# Altium project MAX268.PrjPCB
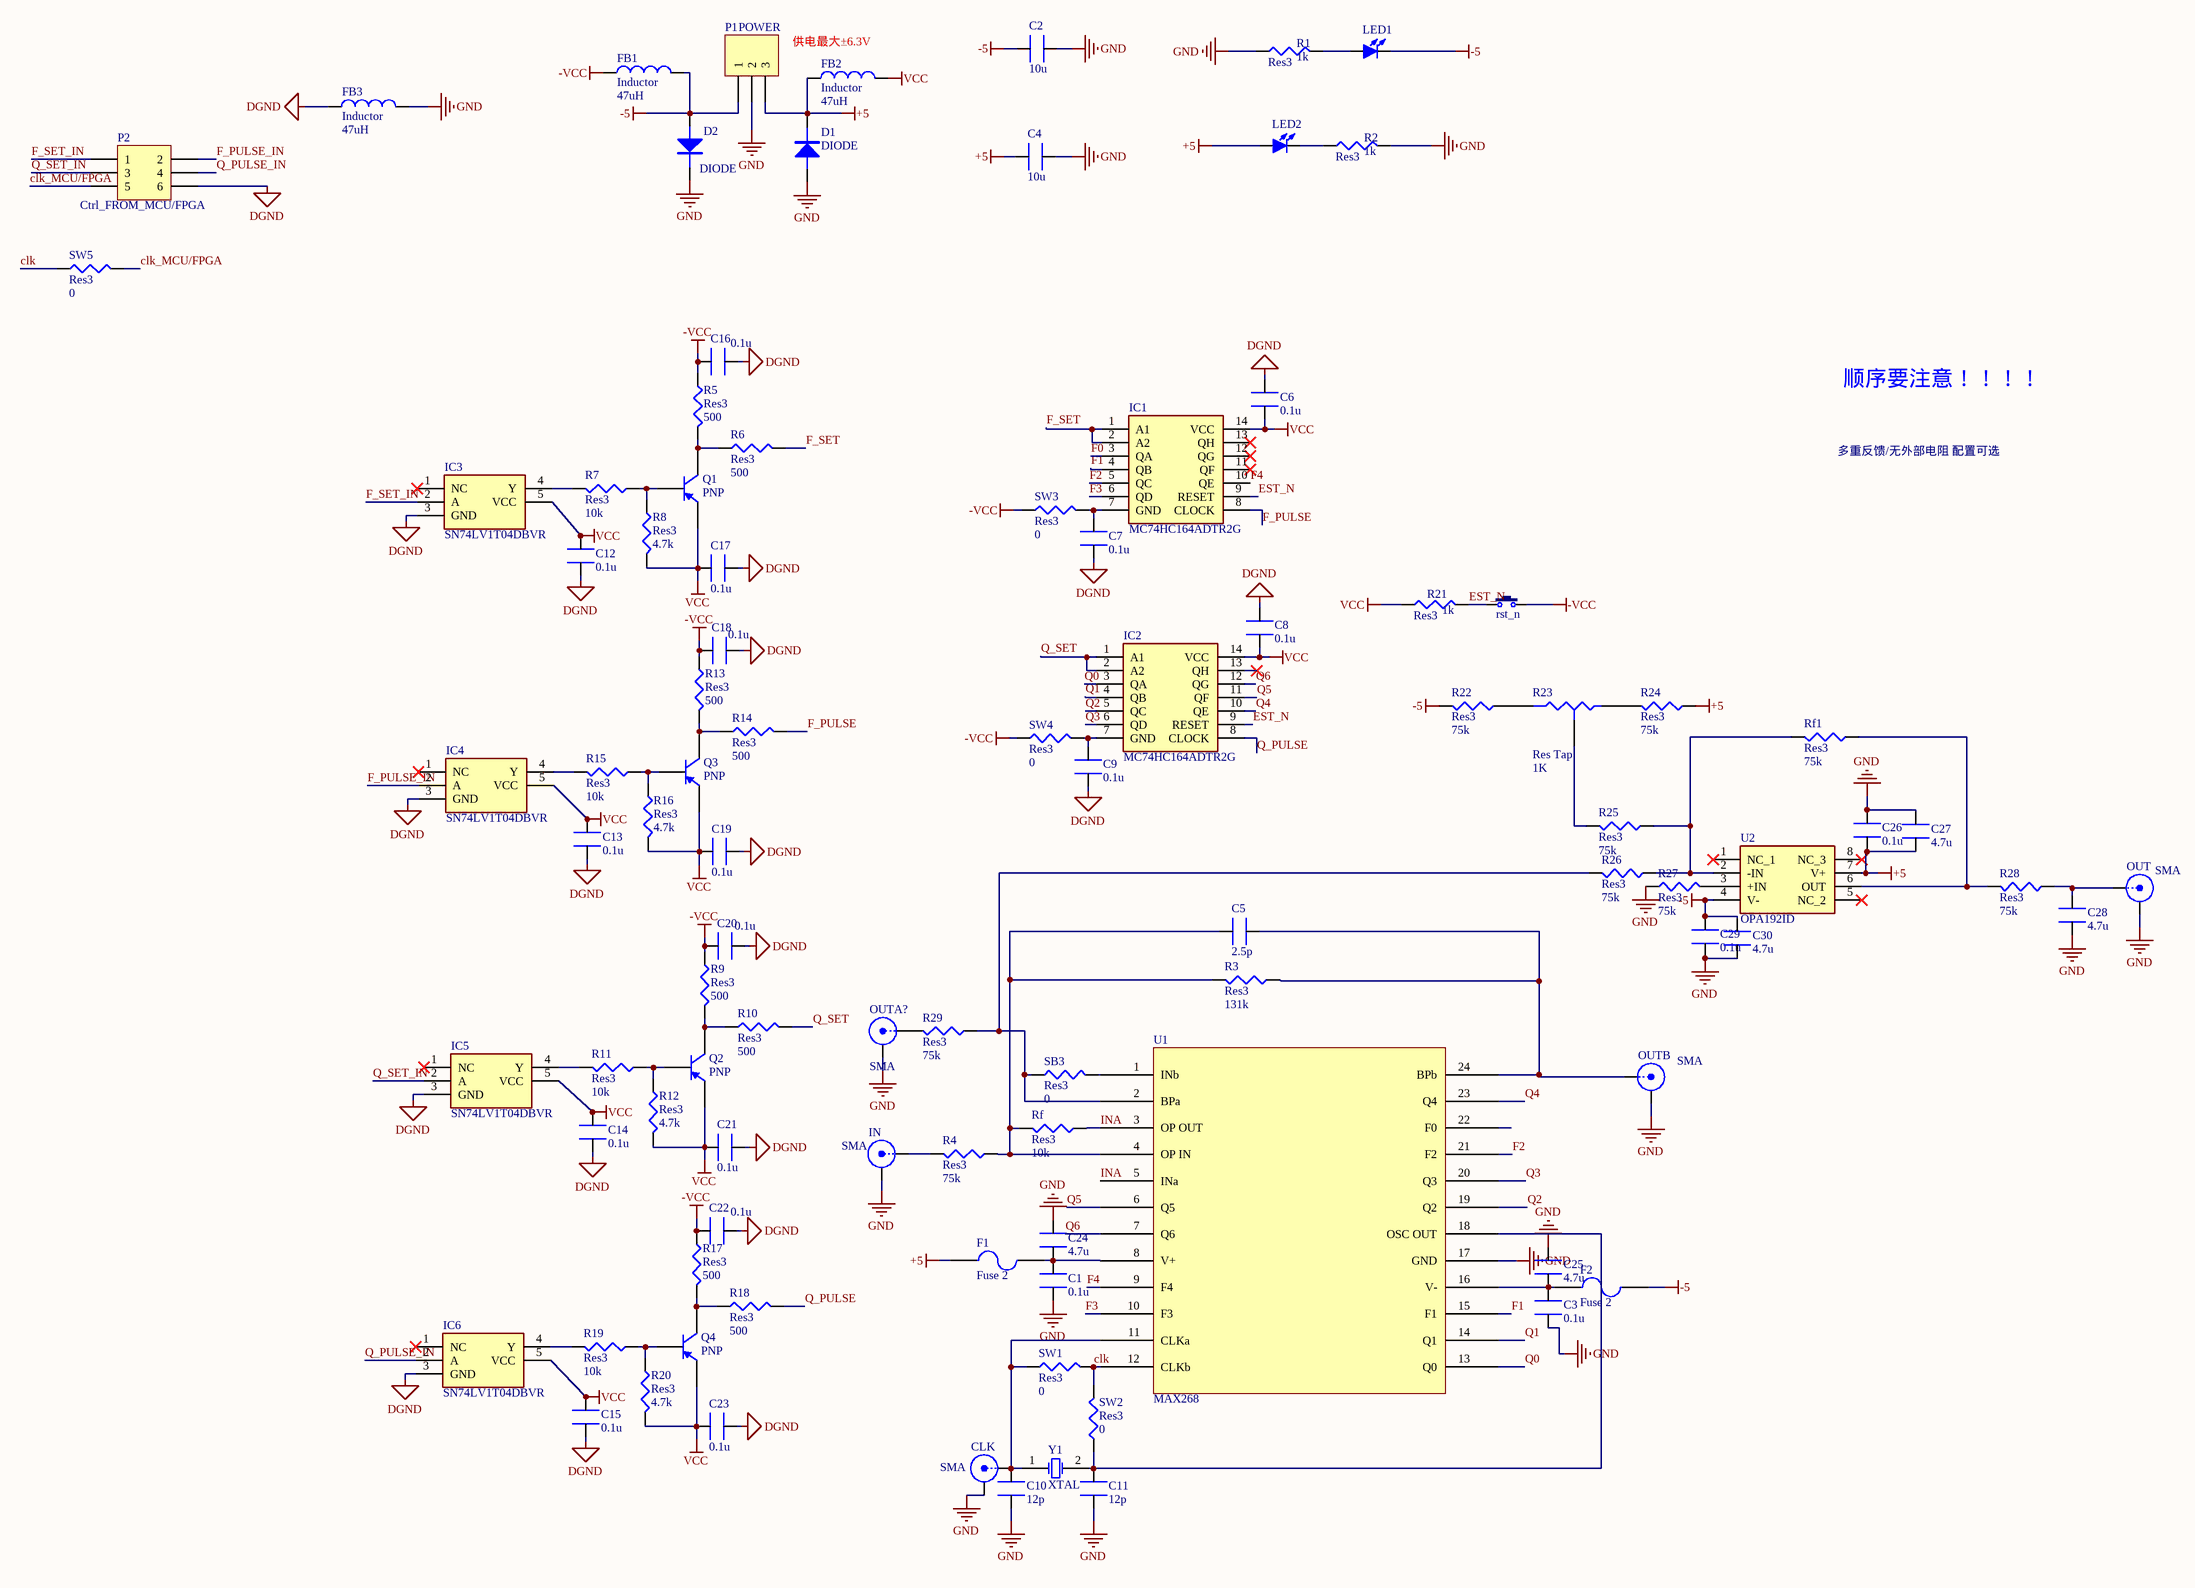
[diagram p0: MAX268.SchDoc]
1 sheet, 97 parts. Net scope: global (net labels, ports and power ports of the same name join across sheets).
Board file: max268.PcbDoc

## Sheet MAX268.SchDoc
size A2; Organization: Altium Limited; Address1: L3, 12a Rodborough Rd; Address2: Frenchs Forest; Address3: NSW; Address4: Australia 2086

### Parts
C1  0.1u  [0805D]
C2  10u  [0805D]
C3  0.1u  [0805D]
C4  10u  [0805D]
C5  2.5p  [0805D]
C6  0.1u  [0805D]
C7  0.1u  [0805D]
C8  0.1u  [0805D]
C9  0.1u  [0805D]
C10  12p  [0805D]
C11  12p  [0805D]
C12  0.1u  [0805D]
C13  0.1u  [0805D]
C14  0.1u  [0805D]
C15  0.1u  [0805D]
C16  0.1u  [0805D]
C17  0.1u  [0805D]
C18  0.1u  [0805D]
C19  0.1u  [0805D]
C20  0.1u  [0805D]
C21  0.1u  [0805D]
C22  0.1u  [0805D]
C23  0.1u  [0805D]
C24  4.7u  [0805D]
C25  4.7u  [0805D]
C26  0.1u  [0805D]
C27  4.7u  [0805D]
C28  4.7u  [0805D]
C29  0.1u  [0805D]
C30  4.7u  [0805D]
CLK  SMA  [SMA1]
D1  DIODE  [1206A]
D2  DIODE  [1206A]
F1  Fuse 2  [0805D]
F2  Fuse 2  [0805D]
FB1  Inductor  value 47uH  [0805D]
FB2  Inductor  value 47uH  [0805D]
FB3  Inductor  value 47uH  [0805D]
IC1  MC74HC164ADTR2G  [SOP65P640X120-14N]
IC2  MC74HC164ADTR2G  [SOP65P640X120-14N]
IC3  SN74LV1T04DBVR  [SOT95P280X145-5N]
IC4  SN74LV1T04DBVR  [SOT95P280X145-5N]
IC5  SN74LV1T04DBVR  [SOT95P280X145-5N]
IC6  SN74LV1T04DBVR  [SOT95P280X145-5N]
IN  SMA  [SMA1]
LED1  (no value)  [0805D]
LED2  (no value)  [0805D]
OUT  SMA  [SMA1]
OUTA?  SMA  [SMA1]
OUTB  SMA  [SMA1]
P1  POWER  [HDR1X3]
P2  Ctrl_FROM_MCU/FPGA  [HDR2X3]
Q1  PNP  [SOT-23B_M]
Q2  PNP  [SOT-23B_M]
Q3  PNP  [SOT-23B_M]
Q4  PNP  [SOT-23B_M]
R1  Res3  value 1k  [0805D]
R2  Res3  value 1k  [0805D]
R3  Res3  value 131k  [0805D]
R4  Res3  value 75k  [0805D]
R5  Res3  value 500  [0805D]
R6  Res3  value 500  [0805D]
R7  Res3  value 10k  [0805D]
R8  Res3  value 4.7k  [0805D]
R9  Res3  value 500  [0805D]
R10  Res3  value 500  [0805D]
R11  Res3  value 10k  [0805D]
R12  Res3  value 4.7k  [0805D]
R13  Res3  value 500  [0805D]
R14  Res3  value 500  [0805D]
R15  Res3  value 10k  [0805D]
R16  Res3  value 4.7k  [0805D]
R17  Res3  value 500  [0805D]
R18  Res3  value 500  [0805D]
R19  Res3  value 10k  [0805D]
R20  Res3  value 4.7k  [0805D]
R21  Res3  value 1k  [0805D]
R22  Res3  value 75k  [0805D]
R23  Res Tap  value 1K  [VR3]
R24  Res3  value 75k  [0805D]
R25  Res3  value 75k  [0805D]
R26  Res3  value 75k  [0805D]
R27  Res3  value 75k  [0805D]
R28  Res3  value 75k  [0805D]
R29  Res3  value 75k  [0805D]
Rf  Res3  value 10k  [0805D]
Rf1  Res3  value 75k  [0805D]
rst_n  3x6x5  [TSW SMD-3*6*5]  (value not drawn)
SB3  Res3  value 0  [0805D]
SW1  Res3  value 0  [0805D]
SW2  Res3  value 0  [0805D]
SW3  Res3  value 0  [0805D]
SW4  Res3  value 0  [0805D]
SW5  Res3  value 0  [0805D]
U1  MAX268  [DIP24]
U2  OPA192ID  [SOIC127P600X175-8N]
Y1  XTAL  [XTAL-49S DIP]

### Nets
+5: C4.1(SD) C26.2(SD) C27.1(SD) D1.K F1.1 FB2.1 LED2.1(A) P1.3 R24.1 U2.7(V+)
-5: C2.1(SD) C29.2(SD) C30.2(SD) D2.A F2.2 FB1.2 LED1.2(K) P1.1 R22.2 U2.4(V-)
-VCC: C16.1(SD) C18.1(SD) C20.1(SD) C22.1(SD) FB1.1 R5.1 R9.1 R13.1 R17.1 rst_n.2 SW3.1 SW4.1
DGND: C6.2(SD) C7.2(SD) C8.2(SD) C9.2(SD) C12.2(SD) C13.2(SD) C14.2(SD) C15.2(SD) C16.2(SD) C17.2(SD) C18.2(SD) C19.2(SD) C20.2(SD) C21.2(SD) C22.2(SD) C23.2(SD) FB3.1 IC3.3(GND) IC4.3(GND) IC5.3(GND) IC6.3(GND) P2.6
GND: C1.1(SD) C2.2(SD) C3.1(SD) C4.2(SD) C10.1(SD) C11.1(SD) C24.2(SD) C25.2(SD) C26.1(SD) C27.2(SD) C28.1(SD) C29.1(SD) C30.1(SD) CLK.2(Y) D1.A D2.K FB3.2 IN.2(Y) OUT.2(Y) OUTA?.2(Y) OUTB.2(Y) P1.2 R1.1 R2.2 R27.2 U1.17(GND)
VCC: C6.1(SD) C8.1(SD) C12.1(SD) C13.1(SD) C14.1(SD) C15.1(SD) C17.1(SD) C19.1(SD) C21.1(SD) C23.1(SD) FB2.2 IC1.14(VCC) IC2.14(VCC) IC3.5(VCC) IC4.5(VCC) IC5.5(VCC) IC6.5(VCC) Q1.3(E) Q2.3(E) Q3.3(E) Q4.3(E) R8.2 R12.2 R16.2 R20.2 R21.1
clk: SW1.2 SW2.2 SW5.1 U1.12(CLKb)
clk_MCU/FPGA: P2.5 SW5.2
EST_N: IC1.9(RESET) IC2.9(RESET) R21.2 rst_n.1
F0: IC1.3(QA)
F1: IC1.4(QB) U1.15(F1)
F2: IC1.5(QC) U1.21(F2)
F3: IC1.6(QD) U1.10(F3)
F4: IC1.10(QE) U1.9(F4)
F_PULSE: IC1.8(CLOCK) R14.2
F_PULSE_IN: IC4.2(A) P2.2
F_SET: IC1.1(A1) IC1.2(A2) R6.2
F_SET_IN: IC3.2(A) P2.1
INA: Rf.1 U1.3(OP_OUT) U1.5(INa)
Q0: IC2.3(QA) U1.13(Q0)
Q1: IC2.4(QB) U1.14(Q1)
Q2: IC2.5(QC) U1.19(Q2)
Q3: IC2.6(QD) U1.20(Q3)
Q4: IC2.10(QE) U1.23(Q4)
Q5: IC2.11(QF) U1.6(Q5)
Q6: IC2.12(QG) U1.7(Q6)
Q_PULSE: IC2.8(CLOCK) R18.2
Q_PULSE_IN: IC6.2(A) P2.4
Q_SET: IC2.1(A1) IC2.2(A2) R10.2
Q_SET_IN: IC5.2(A) P2.3
NetC1_2: C1.2(SD) C24.1(SD) F1.2 U1.8(V+)
NetC3_2: C3.2(SD) C25.1(SD) F2.1 U1.16(V-)
NetC5_1: C5.1(SD) R3.2 R4.1 Rf.2 U1.4(OP_IN)
NetC5_2: C5.2(SD) OUTB.1(X) R3.1 U1.24(BPb)
NetC7_1: C7.1(SD) IC1.7(GND) SW3.2
NetC9_1: C9.1(SD) IC2.7(GND) SW4.2
NetC10_2: C10.2(SD) CLK.1(X) SW1.1 U1.11(CLKa) Y1.1(OSC1)
NetC11_2: C11.2(SD) SW2.1 U1.18(OSC_OUT) Y1.2(OSC2)
NetC28_2: C28.2(SD) OUT.1(X) R28.1
NetIC3_4: IC3.4(Y) R7.2
NetIC4_4: IC4.4(Y) R15.2
NetIC5_4: IC5.4(Y) R11.2
NetIC6_4: IC6.4(Y) R19.2
NetIN_1: IN.1(X) R4.2
NetLED1_1: LED1.1(A) R1.2
NetLED2_2: LED2.2(K) R2.1
NetOUTA?_1: OUTA?.1(X) R29.2
NetQ1_1: Q1.1(C) R5.2 R6.1
NetQ1_2: Q1.2(B) R7.1 R8.1
NetQ2_1: Q2.1(C) R9.2 R10.1
NetQ2_2: Q2.2(B) R11.1 R12.1
NetQ3_1: Q3.1(C) R13.2 R14.1
NetQ3_2: Q3.2(B) R15.1 R16.1
NetQ4_1: Q4.1(C) R17.2 R18.1
NetQ4_2: Q4.2(B) R19.1 R20.1
NetR22_1: R22.1 R23.2(B)
NetR23_1: R23.1(A) R24.2
NetR23_3: R23.3(TAP) R25.2
NetR25_1: R25.1 R26.1 Rf1.2 U2.2(-IN)
NetR26_2: R26.2 R29.1 SB3.1 U1.2(BPa)
NetR27_1: R27.1 U2.3(+IN)
NetR28_2: R28.2 Rf1.1 U2.6(OUT)
NetSB3_2: SB3.2 U1.1(INb)

Not connected (* = marked no-connect by the designer): IC1 11(QF)* 12(QG)* 13(QH)*; IC2 13(QH)*; IC3 1(NC)*; IC4 1(NC)*; IC5 1(NC)*; IC6 1(NC)*; U1 22(F0); U2 1(NC_1)* 5(NC_2)* 8(NC_3)*

### Notes on the sheet
- 供电最大±6.3V
- 顺序要注意！！！！
- 多重反馈/无外部电阻 配置可选
- Title
- Size:
- Date:
- File:
- A2
- Number:
- Time:
- Revision:
- Sheet
- of

### Library data of the parts
C1-C30 = CAP_T
CLK IN OUT OUTA? OUTB = BNC: BNC Elbow Connector; LatestRevisionDate: 17-Jul-2002; LatestRevisionNote: Re-released for DXP Platform.; Publisher: Altium Limited
F1 F2 = Fuse 2: Fuse; Published: 8-Jun-2000; LatestRevisionDate: 17-Jul-2002; LatestRevisionNote: Re-released for DXP Platform.; PackageReference: PIN-W2/E2.8; Publisher: Altium Limited; PackageDescription: Thru-Hole; 2 Leads
FB1-FB3 = Inductor: Code_IEC: 1005; Published: 8-Jun-2000; LatestRevisionDate: 29-May-2009; LatestRevisionNote: IPC-7351 Footprint Added.; PackageReference: 0402-A; Publisher: Altium Limited; PackageDescription: Chip Inductor; Code_JEITA: 0402
IC1 IC2 = MC74HC164ADTR2G: Integrated Circuit; Manufacturer_Name: ON Semiconductor; Datasheet Link: http://www.onsemi.com/pub/Collateral/MC74HC164A-D.PDF; Height: 1.2mm; Manufacturer_Part_Number: MC74HC164ADTR2G; Mouser Part Number: 863-MC74HC164ADTR2G; Mouser Price/Stock: https://www.mouser.co.uk/ProductDetail/ON-Semiconductor/MC74HC164ADTR2G?qs=qg33o%252B8vzFo2YIOUdQuHFw%3D%3D; Arrow Part Number: MC74HC164ADTR2G; Arrow Price/Stock: https://www.arrow.com/en/products/mc74hc164adtr2g/on-semiconductor
IC3-IC6 = SN74LV1T04DBVR: Integrated Circuit; Manufacturer_Name: Texas Instruments; Datasheet Link: http://www.ti.com/lit/gpn/sn74lv1t04; Height: 1.45mm; Manufacturer_Part_Number: SN74LV1T04DBVR; Mouser Part Number: 595-SN74LV1T04DBVR; Mouser Price/Stock: https://www.mouser.co.uk/ProductDetail/Texas-Instruments/SN74LV1T04DBVR?qs=igp4D3uu33KtAfuFlk2jSg%3D%3D; Arrow Part Number: SN74LV1T04DBVR; Arrow Price/Stock: https://www.arrow.com/en/products/sn74lv1t04dbvr/texas-instruments
LED1 LED2 = LED-SMD: 贴片LED; 版权归属: 源创客; BOM名称: 贴片LED; 学习资源: www.ooocke.com
P1 = Header 3: Header, 3-Pin; LatestRevisionDate: 17-Jul-2002; LatestRevisionNote: Re-released for DXP Platform.; Publisher: Altium Limited
P2 = Header 3X2: Header, 3-Pin, Dual row; LatestRevisionDate: 17-Jul-2002; LatestRevisionNote: Re-released for DXP Platform.; Publisher: Altium Limited
Q1-Q4 = PNP: PNP Bipolar Transistor; Published: 8-Jun-2000; LatestRevisionDate: 29-May-2009; LatestRevisionNote: IPC-7351 Footprint Added.; PackageVersion: Aug-1999; PackageReference: SOT-23B; Publisher: Altium Limited; PackageDescription: 3-Pin SOT-23 Package 0.95 mm Pitch, 2.4 mm Lead Span
R1-R22 R24-R29 Rf Rf1 SB3 SW1-SW5 = Res3: Resistor; Published: 8-Jun-2000; LatestRevisionDate: 29-May-2009; LatestRevisionNote: IPC-7351 Footprint Added.; PackageReference: J1-0603; Publisher: Altium Limited; PackageDescription: Chip Resistor
R23 = Res Tap: Tapped Resistor; Sim Note: Enter the Resistance value and the set point into parameter fields.; Set Position: 0.5; Published: 24-Mar-1999; LatestRevisionDate: 17-Jul-2002; LatestRevisionNote: Re-released for DXP Platform.; PackageReference: VR3; Publisher: Altium Limited; PackageDescription: Variable Resistor, Thru-Hole; 3 Leads
rst_n = TSW 3x6: 3x6轻触开关; 版权归属: 源创客; BOM名称: 3x6轻触开关; 学习资源: www.ooocke.com
U2 = OPA192ID: Undefined or Miscellaneous; Manufacturer_Name: Texas Instruments; Datasheet Link: http://www.ti.com/lit/ds/symlink/opa192.pdf; Height: 1.75mm; Manufacturer_Part_Number: OPA192ID; Mouser Part Number: 595-OPA192ID; Mouser Price/Stock: https://www.mouser.co.uk/ProductDetail/Texas-Instruments/OPA192ID?qs=wrT8kFYR779tQjMORwdPeQ%3D%3D; Arrow Part Number: OPA192ID; Arrow Price/Stock: https://www.arrow.com/en/products/opa192id/texas-instruments?region=nac
Y1 = XTAL: Crystal Oscillator; Published: 8-Jun-2000; LatestRevisionDate: 17-Jul-2002; LatestRevisionNote: Re-released for DXP Platform.; PackageReference: R38; Publisher: Altium Limited; PackageDescription: Crystal, Thru-Hole; 2 Leads; Body 3.1 x 8.2 mm (Dia.xH)